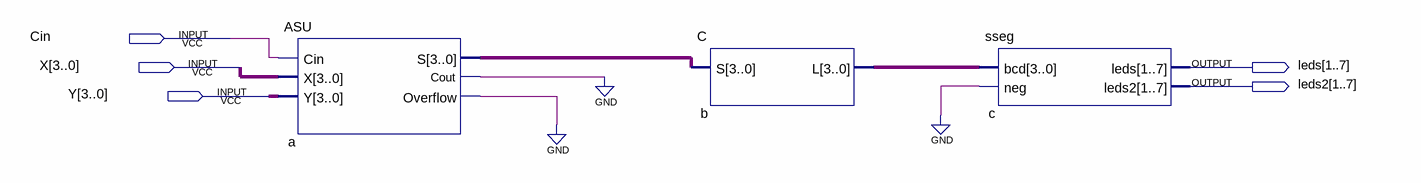
[diagram p0: schematic sheet]
// Quartus schematic CombinedASU2.bdf as structural Verilog: 3 symbols, 5 pins
module CombinedASU2 (
  input  Cin,
  input  [3:0] X,
  input  [3:0] Y,
  output [1:7] leds,
  output [1:7] leds2
);

  wire a_cout, a_overflow;
  wire [3:0] a_s, b_l;

  ASU a (.Cin(Cin), .X(X), .Y(Y), .S(a_s), .Cout(a_cout), .Overflow(a_overflow));
  C b (.S(a_s), .L(b_l));
  sseg c (.bcd(b_l), .neg(1'b0), .leds(leds), .leds2(leds2));
  // also tied to GND on the sheet: {a_cout, a_overflow}
endmodule
